# EAGLE design power (EAGLE 7.0.0)
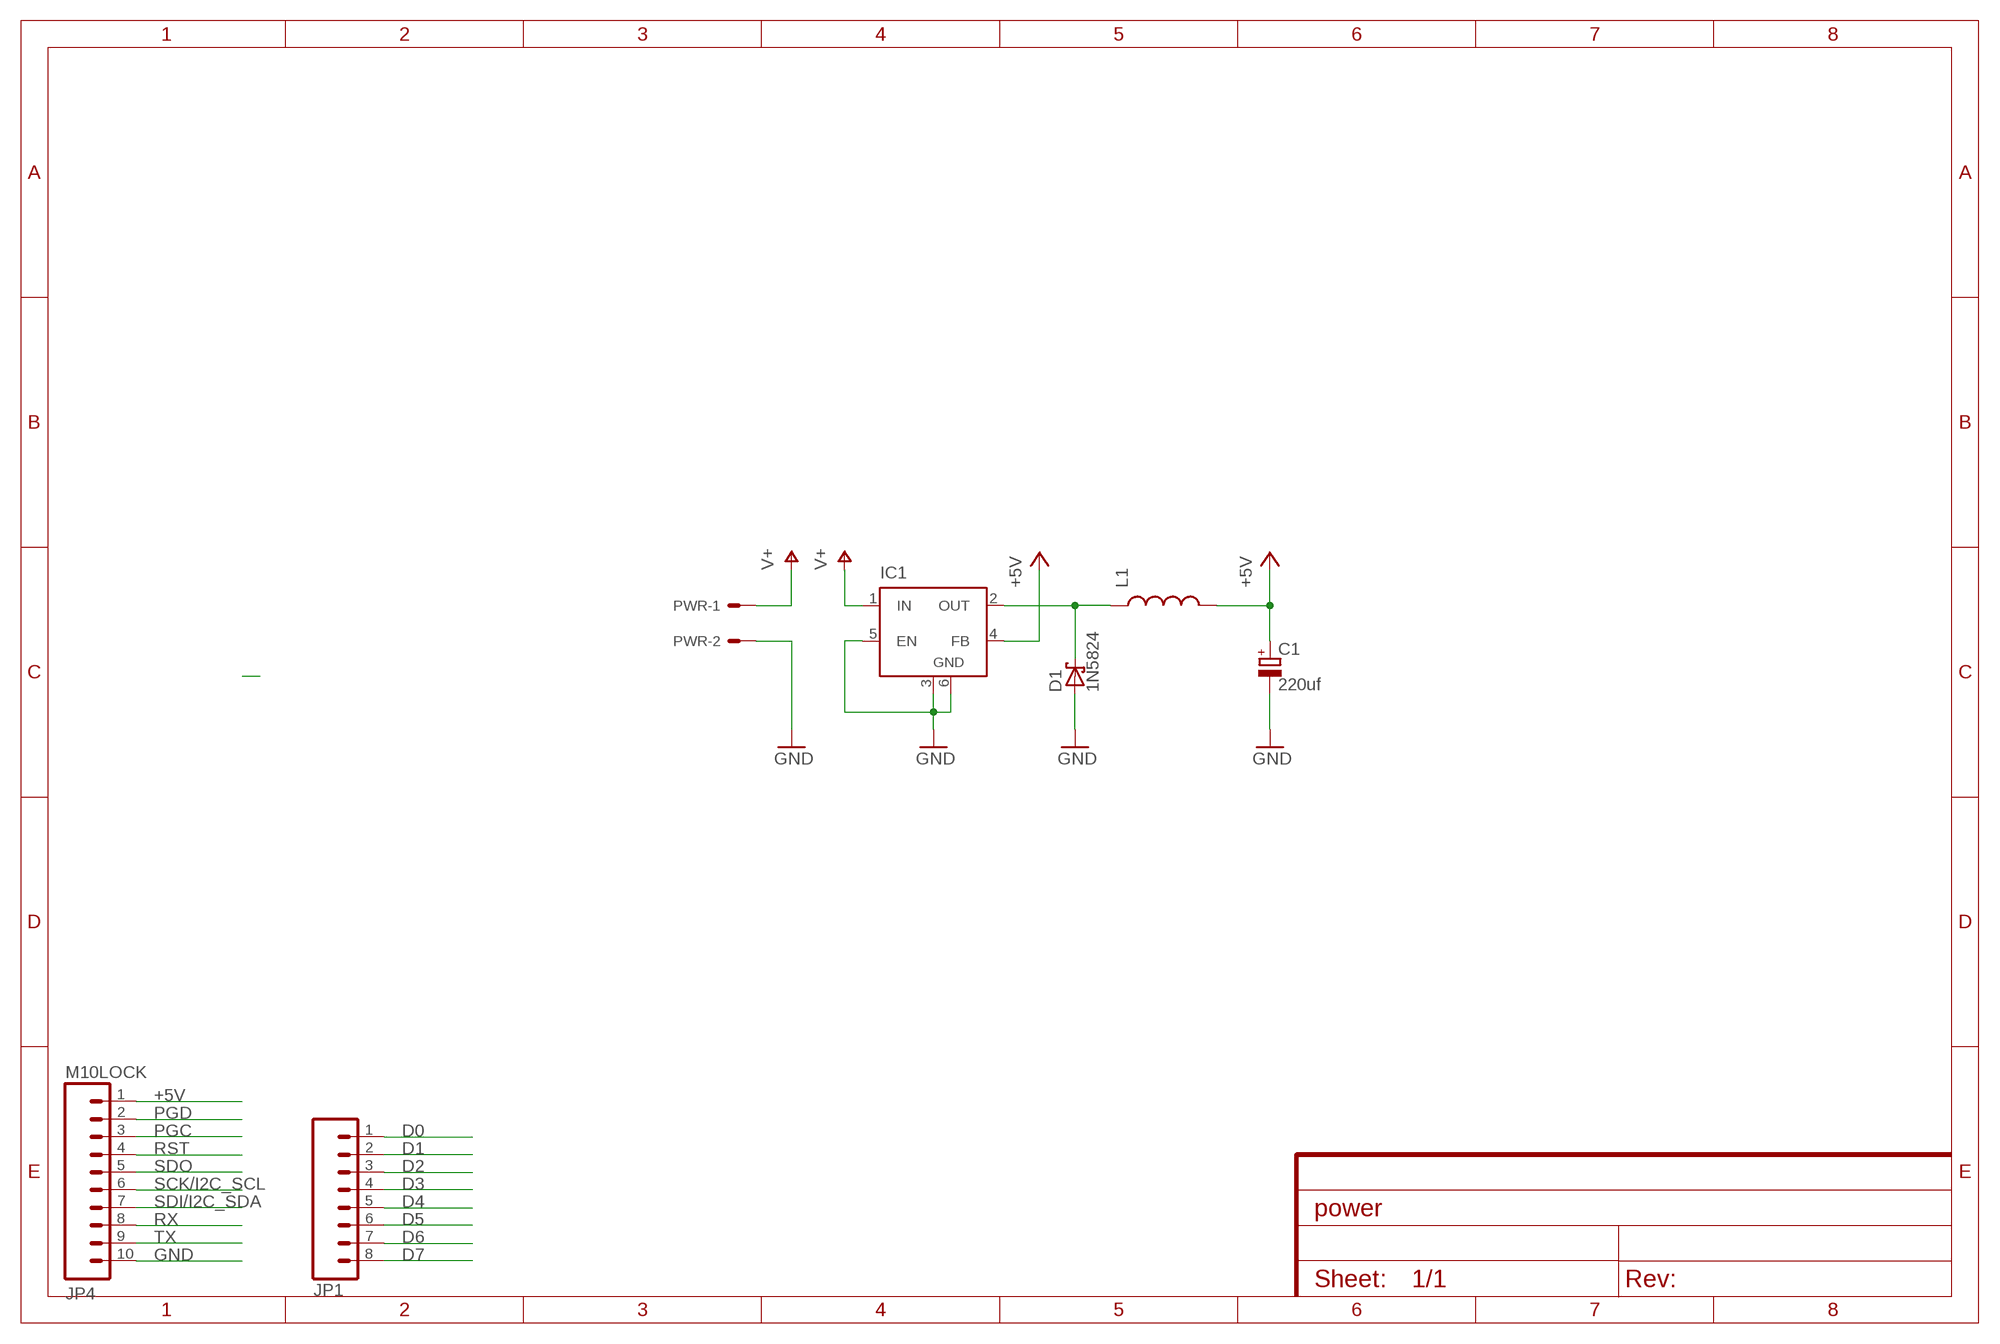
[diagram p0: schematic, sheet 1]

## Parts
C1  220uf  CPOL-EUE2.5-6  [E2,5-6]
D1  1N5824  1N5817-B  [DO41-7.6]
IC1  LM2596S  [TO263-5]
JP1  M08LOCK  [1X08_LOCK]
JP4  M10LOCK  [1X10_LOCK]
L1  INDUCTORSRU1038  [SRU1038]
PWR  22-05-7028-02  [7395-02]

## Nets
+5V: C1.+ IC1.4(FB) JP4.1 L1.2
D0: JP1.1
D1: JP1.2
D2: JP1.3
D3: JP1.4
D4: JP1.5
D5: JP1.6
D6: JP1.7
D7: JP1.8
GND: C1.- D1.A IC1.3(GND) IC1.5(EN) IC1.6(GND) JP4.10 PWR.2
PGC: JP4.3
PGD: JP4.2
RST: JP4.4
RX: JP4.8
SCK/I2C_SCL: JP4.6
SDI/I2C_SDA: JP4.7
SDO: JP4.5
TX: JP4.9
V+: IC1.1(IN) PWR.1
VOUT: D1.C IC1.2(OUT) L1.1

## Library data of the parts
C1 = rcl:CPOL-EU: POLARIZED CAPACITOR, European symbol
D1 = diode:1N581*: 1.0A SCHOTTKY BARRIER RECTIFIER Source: http://www.diodes.com/datasheets/ds23001.pdf
IC1 = linear:LM2596S: STEP-DOWN VOLTAGE REGULATOR
JP1 = SparkFun-Connectors:M08: Header 8 Standard 8-pin 0.1" header. Use with straight break away headers (SKU : PRT-00116), right angle break away headers (PRT-00553), swiss pins (PRT-00743), machine pins (PRT-00117), and female headers (PRT-00115).
JP4 = SparkFun-Connectors:M10: Header 10 Standard 10-pin 0.1" header. Use with straight break away headers (SKU : PRT-00116), right angle break away headers (PRT-00553), swiss pins (PRT-00743), machine pins (PRT-00117), and female headers (PRT-00115).
L1 = SparkFun-Passives:INDUCTOR: Inductors Basic Inductor/Choke - 0603 and 1206. Footprints are not proven and vary greatly between part numbers. SRN6045- 33uH, 20% 1.4A SDR0403-560KL - 56uH, 10%, 500mA RMS/740mA peak
PWR = con-molex:22-?-02: CONNECTOR wire to board 2.54 mm (.1 inch) pitch header; OC_FARNELL: 9731601; OC_NEWARK: unknown

## Board
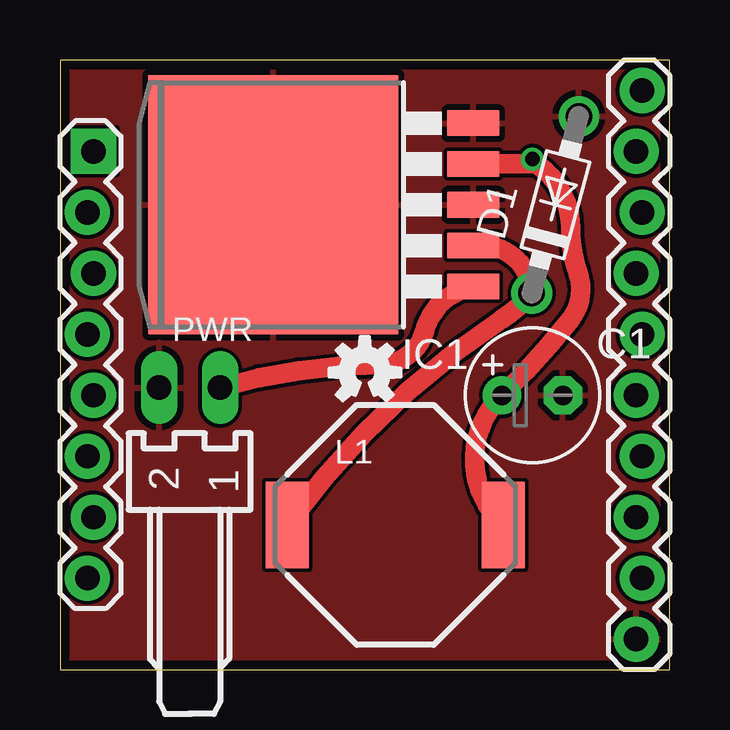
[diagram p1: board, top side]
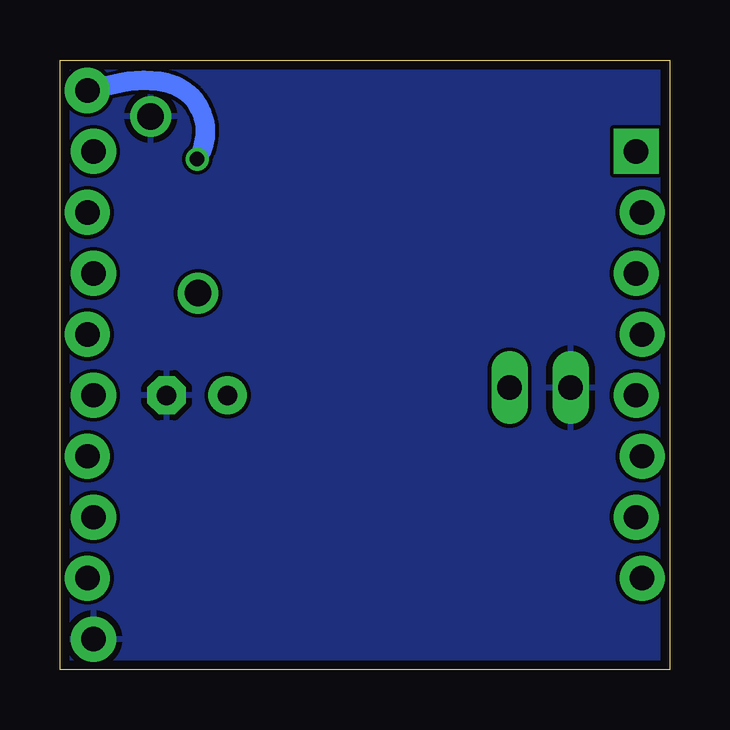
[diagram p2: board, bottom side, seen from below]

Size 25.4 x 25.4 mm. Coordinates in mm from the lower left corner, seen from the top.
Outline: 0,0 25.4,0 25.4,25.4 0,25.4 0,0
Copper layers (1*16): Top 0.0356mm / dielectric 1.5011mm / Bottom 0.0356mm
Design rules "LaenPCBOrder": minimum track width 6mil, minimum drill 13mil, track to track 6mil, track to pad 6mil, pad to pad 6mil, via to via 6mil, smd to smd 6mil, copper to edge 15mil, drill to drill 6mil, minimum pad ring 7mil, minimum via ring 7mil, stop-mask expansion 3mil, vias tented up to drill 0mil, thermal gap 10mil

### Footprints (pad centres in the part's own frame; a part is rotated, then mirrored left to right if it is on the bottom)
E2,5-6 = drill 0.813 pad 1.6: + -1.27,0 | drill 0.813 pad 1.6 octagon: - 1.27,0
DO41-7.6 = drill 1.1 pad 1.7: A 3.81,0; C -3.81,0
TO263-5 = smd 1.067 x 2.159: 1 -3.404,-5.791; 2 -1.702,-5.791; 3 0,-5.791; 4 1.702,-5.791; 5 3.404,-5.791 | smd 10.8 x 10.41: 6 0,2.54
1X08_LOCK = drill 1.016 pad 1.88 square: 1 0,0.127 | drill 1.016 pad 1.88: 2 2.54,-0.127; 3 5.08,0.127; 4 7.62,-0.127; 5 10.16,0.127; 6 12.7,-0.127; 7 15.24,0.127; 8 17.78,-0.127
1X10_LOCK = drill 1.016 pad 1.88: 1 0,0.127; 2 2.54,-0.127; 3 5.08,0.127; 4 7.62,-0.127; 5 10.16,0.127; 6 12.7,-0.127; 7 15.24,0.127; 8 17.78,-0.127; 9 20.32,0.127; 10 22.86,-0.127
SRU1038 = smd 1.8 x 3.6: 1 -4.5,0; 2 4.5,0
7395-02 = drill 1.016 long: 1 1.27,0; 2 -1.27,0

### Placement (x,y rotation side)
C1  19.68,11.43 0 top
D1  20.64,19.37 75 top
IC1  11.43,19.37 90 top
JP1  1.27,21.59 270 top
JP4  24.13,24.13 270 top
L1  13.97,6.03 0 top
PWR  5.4,11.75 0 top
U$1  [OSHW-LOGO-S]  12.7,12.38 0 top

### Tracks (layer width: path | path; a pad name or v marks a point on that pad's centre or on a via)
+5V  (via drill 0.6)
  Top 0.813: IC1.4 19.68,21.07 v19.68,21.27 arc23 20,20.95 arc-53 21.27,18.41 arc19 21.59,16.51 arc-57 21.27,14.61 arc-8 C1.+ arc93 L1.2
  Bottom 0.813: JP4.1 22.86,24.45 arc26 20.95,24.45 arc111 v19.68,21.27
GND
  pour Bottom: 0,25.4 25.4,25.4 25.4,0 0,0
  pour Top: 0,25.4 25.4,25.4 25.4,0 0,0
V+
  Top 0.813: PWR.1 arc-16 13.32,12.7 arc79 15.24,14.29 arc-60 IC1.1
VOUT
  Top 0.813: IC1.2 arc-90 19.65,15.87 D1.C arc-16 18.41,14.61 arc21 L1.1